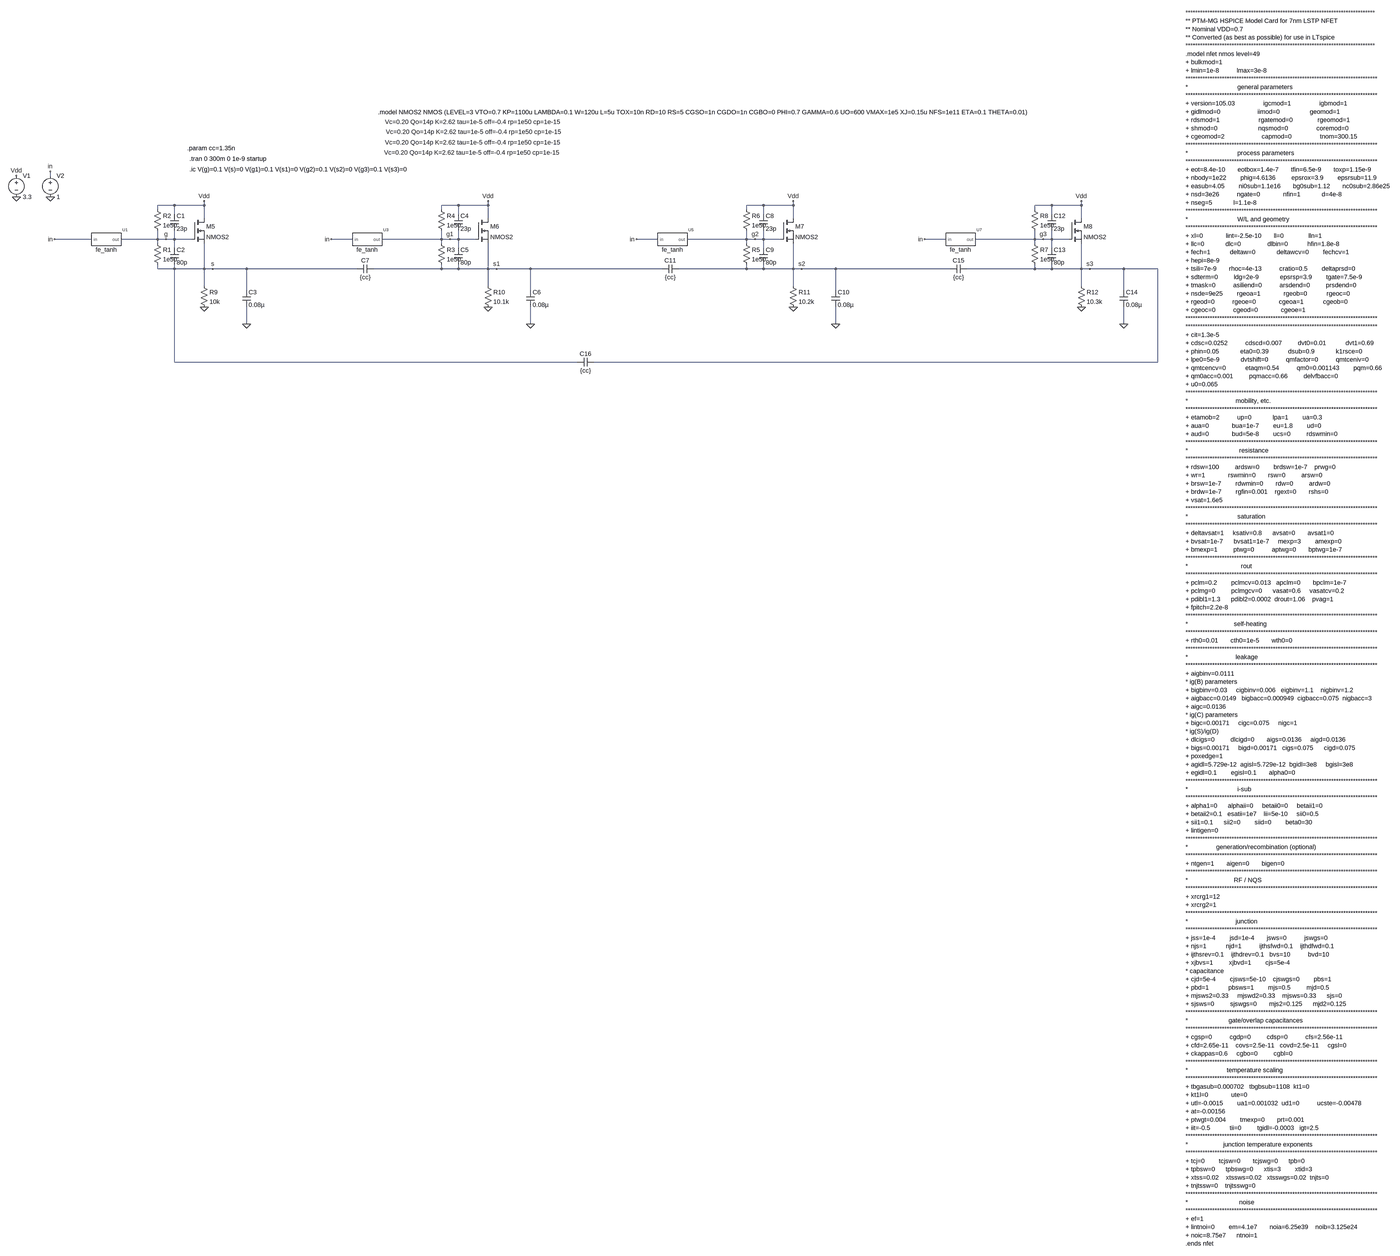
[diagram p0: schematic Oscilador_coupled_transistors.asc, whole sheet]
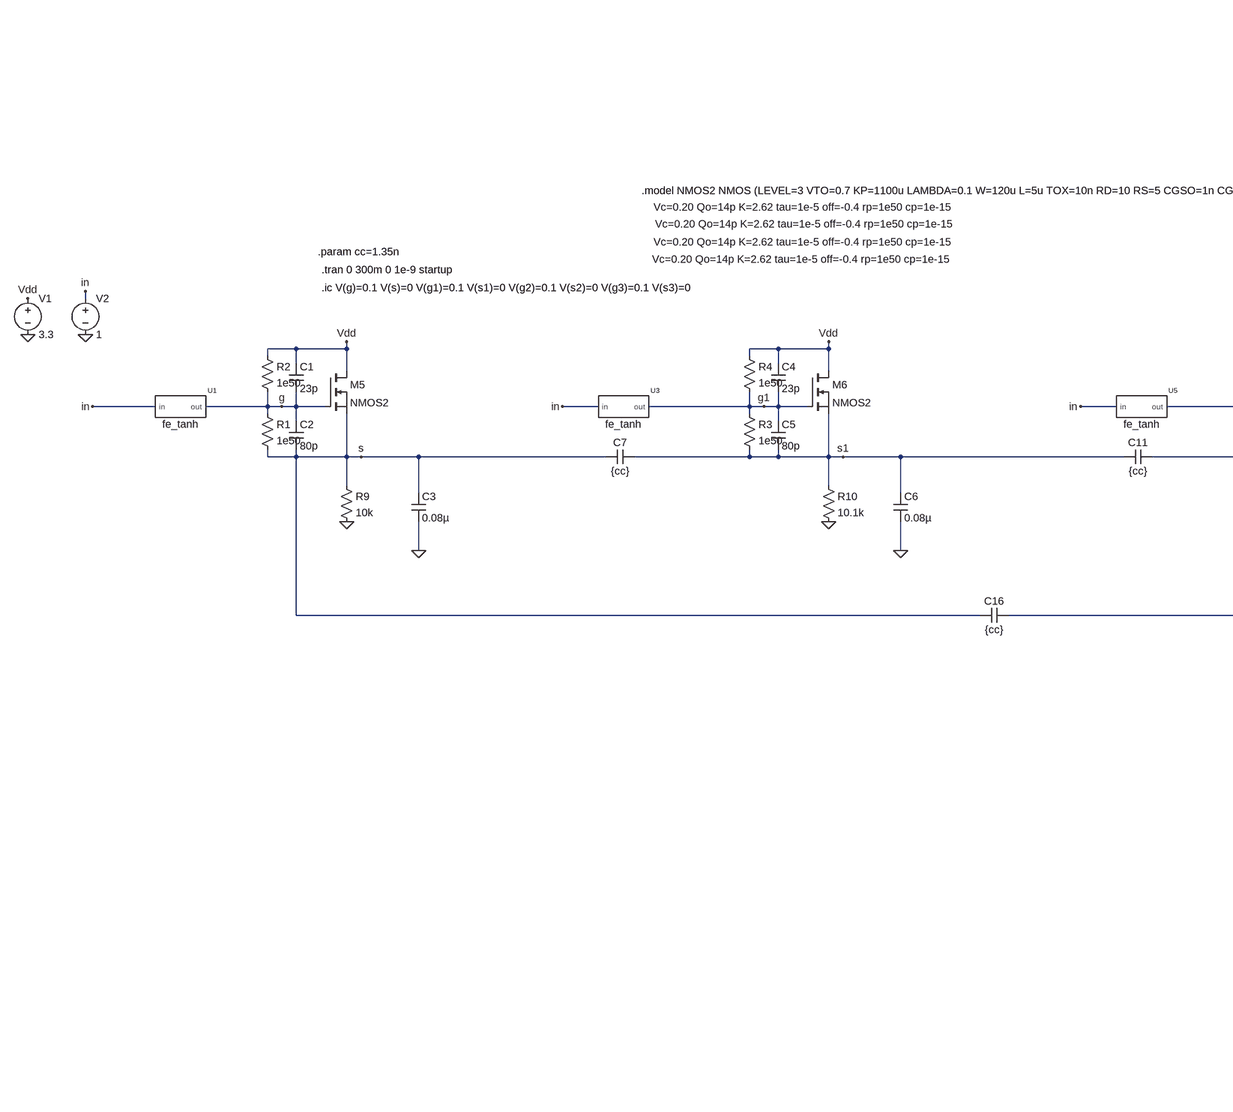
[diagram p1: schematic Oscilador_coupled_transistors.asc, part, row 1 of 2, column 1 of 2]
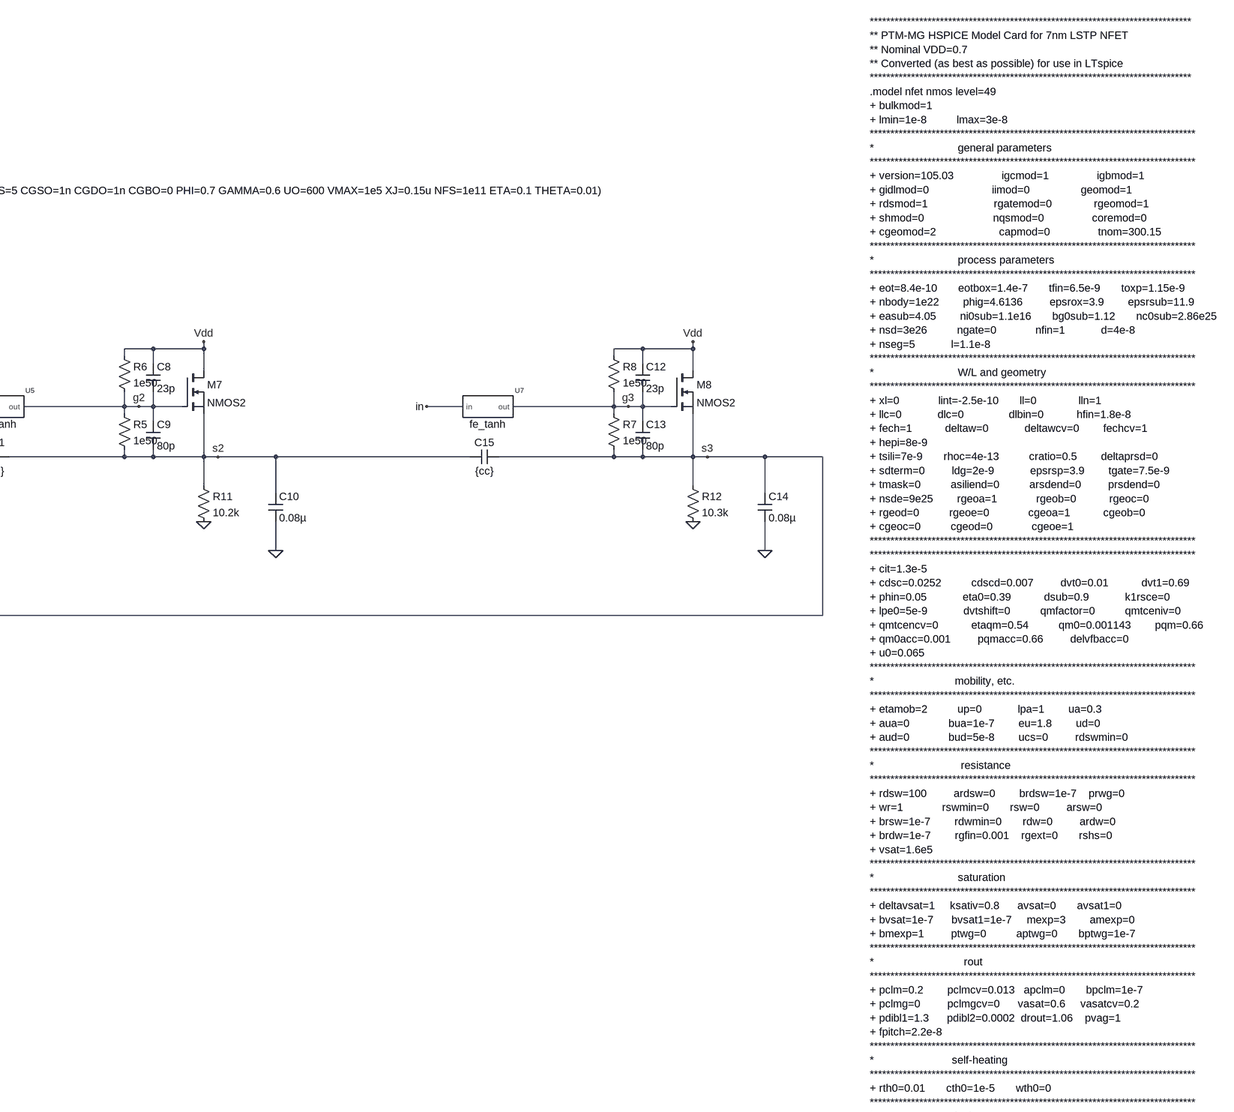
[diagram p2: schematic Oscilador_coupled_transistors.asc, part, row 1 of 2, column 2 of 2]
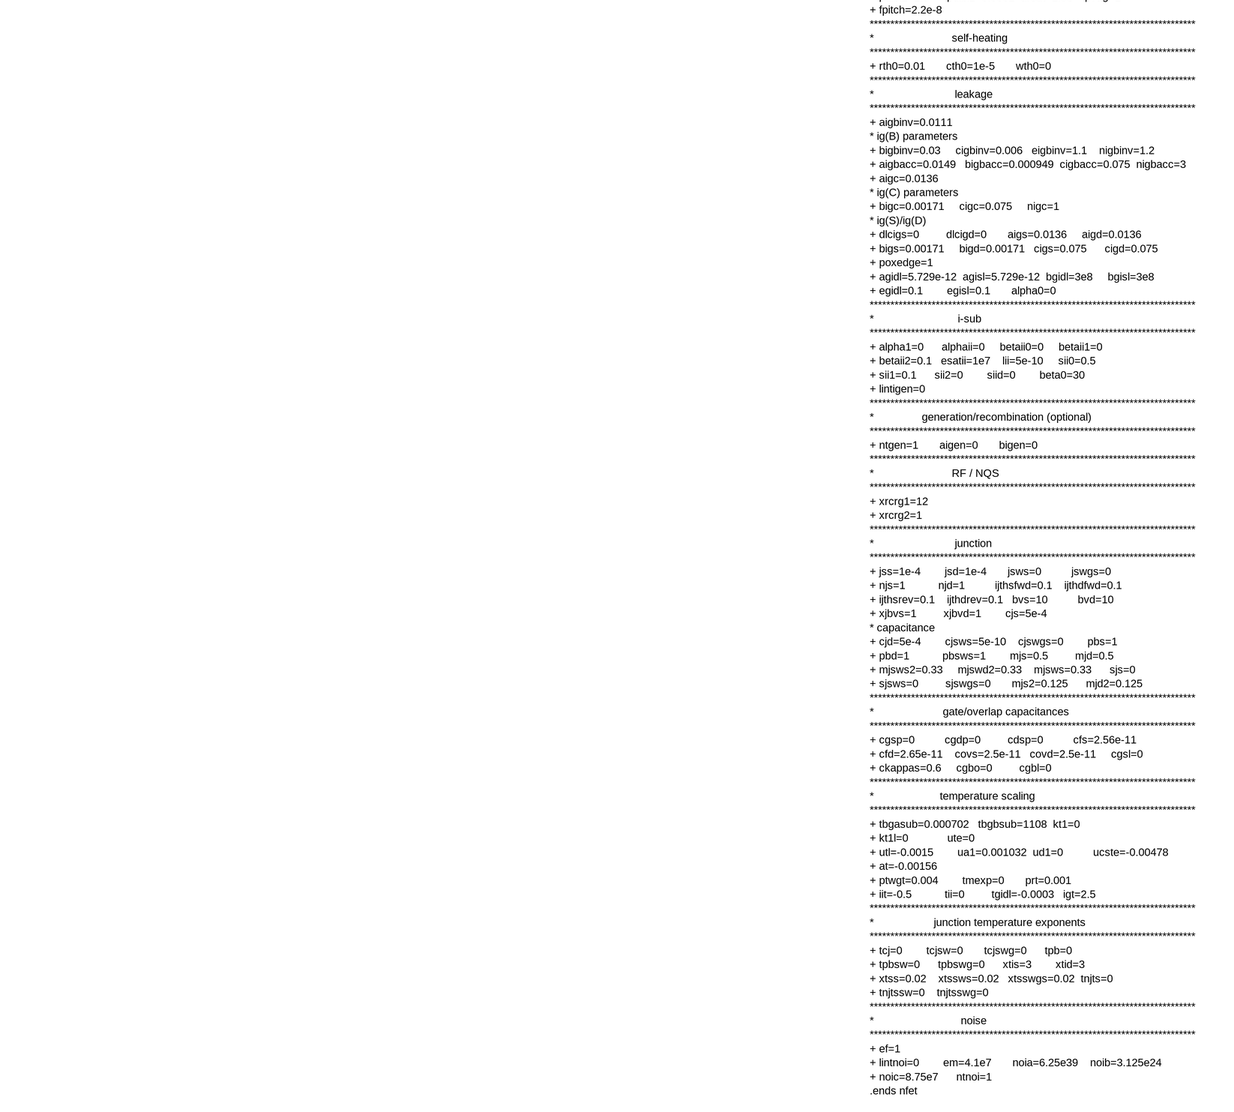
[diagram p3: schematic Oscilador_coupled_transistors.asc, part, row 2 of 2, column 2 of 2]
Oscilador_coupled_transistors.asc, the LTspice schematic file:
Version 4
SHEET 1 6256 3524
WIRE -128 -48 -128 -64
WIRE 576 64 512 64
WIRE 688 64 688 48
WIRE 688 64 576 64
WIRE 1648 64 1584 64
WIRE 1760 64 1760 48
WIRE 1760 64 1648 64
WIRE 2800 64 2736 64
WIRE 2912 64 2912 48
WIRE 2912 64 2800 64
WIRE 3888 64 3824 64
WIRE 4000 64 4000 48
WIRE 4000 64 3888 64
WIRE 512 80 512 64
WIRE 1584 80 1584 64
WIRE 2736 80 2736 64
WIRE 3824 80 3824 64
WIRE 576 96 576 64
WIRE 1648 96 1648 64
WIRE 2800 96 2800 64
WIRE 3888 96 3888 64
WIRE 688 112 688 64
WIRE 1760 112 1760 64
WIRE 2912 112 2912 64
WIRE 4000 112 4000 64
WIRE 176 192 -112 192
WIRE 512 192 512 160
WIRE 512 192 288 192
WIRE 544 192 512 192
WIRE 576 192 576 160
WIRE 576 192 544 192
WIRE 640 192 576 192
WIRE 1248 192 1168 192
WIRE 1584 192 1584 160
WIRE 1584 192 1360 192
WIRE 1616 192 1584 192
WIRE 1648 192 1648 160
WIRE 1648 192 1616 192
WIRE 1712 192 1648 192
WIRE 2400 192 2320 192
WIRE 2736 192 2736 160
WIRE 2736 192 2512 192
WIRE 2768 192 2736 192
WIRE 2800 192 2800 160
WIRE 2800 192 2768 192
WIRE 2864 192 2800 192
WIRE 3488 192 3408 192
WIRE 3824 192 3824 160
WIRE 3824 192 3600 192
WIRE 3856 192 3824 192
WIRE 3888 192 3888 160
WIRE 3888 192 3856 192
WIRE 3952 192 3888 192
WIRE 512 208 512 192
WIRE 1584 208 1584 192
WIRE 2736 208 2736 192
WIRE 3824 208 3824 192
WIRE 576 224 576 192
WIRE 1648 224 1648 192
WIRE 2800 224 2800 192
WIRE 3888 224 3888 192
WIRE 512 304 512 288
WIRE 576 304 576 288
WIRE 576 304 512 304
WIRE 688 304 688 208
WIRE 688 304 576 304
WIRE 720 304 688 304
WIRE 848 304 720 304
WIRE 1264 304 848 304
WIRE 1584 304 1584 288
WIRE 1584 304 1328 304
WIRE 1648 304 1648 288
WIRE 1648 304 1584 304
WIRE 1760 304 1760 208
WIRE 1760 304 1648 304
WIRE 1792 304 1760 304
WIRE 1920 304 1792 304
WIRE 2416 304 1920 304
WIRE 2736 304 2736 288
WIRE 2736 304 2480 304
WIRE 2800 304 2800 288
WIRE 2800 304 2736 304
WIRE 2912 304 2912 208
WIRE 2912 304 2800 304
WIRE 2944 304 2912 304
WIRE 3072 304 2944 304
WIRE 3504 304 3072 304
WIRE 3824 304 3824 288
WIRE 3824 304 3568 304
WIRE 3888 304 3888 288
WIRE 3888 304 3824 304
WIRE 4000 304 4000 208
WIRE 4000 304 3888 304
WIRE 4032 304 4000 304
WIRE 4160 304 4032 304
WIRE 4288 304 4160 304
WIRE 688 368 688 304
WIRE 1760 368 1760 304
WIRE 2912 368 2912 304
WIRE 4000 368 4000 304
WIRE 848 384 848 304
WIRE 1920 384 1920 304
WIRE 3072 384 3072 304
WIRE 4160 384 4160 304
WIRE 848 512 848 448
WIRE 1920 512 1920 448
WIRE 3072 512 3072 448
WIRE 4160 512 4160 448
WIRE 576 656 576 304
WIRE 2096 656 576 656
WIRE 4288 656 4288 304
WIRE 4288 656 2160 656
FLAG -256 32 0
FLAG -256 -48 Vdd
FLAG 688 48 Vdd
FLAG 848 512 0
FLAG -128 32 0
FLAG -112 192 in
FLAG -128 -64 in
FLAG 544 192 g
FLAG 720 304 s
FLAG 1760 48 Vdd
FLAG 1920 512 0
FLAG 1168 192 in
FLAG 1616 192 g1
FLAG 1792 304 s1
FLAG 2912 48 Vdd
FLAG 3072 512 0
FLAG 2320 192 in
FLAG 2768 192 g2
FLAG 2944 304 s2
FLAG 4000 48 Vdd
FLAG 4160 512 0
FLAG 3408 192 in
FLAG 3856 192 g3
FLAG 4032 304 s3
FLAG 4000 448 0
FLAG 2912 448 0
FLAG 1760 448 0
FLAG 688 448 0
SYMBOL voltage -256 -64 R0
WINDOW 123 0 0 Left 0
WINDOW 39 0 0 Left 0
SYMATTR InstName V1
SYMATTR Value 3.3
SYMBOL cap 560 96 R0
SYMATTR InstName C1
SYMATTR Value 23p
SYMBOL cap 560 224 R0
SYMATTR InstName C2
SYMATTR Value 80p
SYMBOL res 496 192 R0
SYMATTR InstName R1
SYMATTR Value 1e50
SYMBOL res 496 64 R0
SYMATTR InstName R2
SYMATTR Value 1e50
SYMBOL cap 832 384 R0
SYMATTR InstName C3
SYMATTR Value 0.08µ
SYMBOL voltage -128 -64 R0
WINDOW 123 0 0 Left 0
WINDOW 39 0 0 Left 0
SYMATTR InstName V2
SYMATTR Value 1
SYMBOL fe_tanh 224 192 R0
WINDOW 39 1480 -459 Top 2
SYMATTR SpiceLine Vc=0.20 Qo=14p K=2.62 tau=1e-5 off=-0.4 rp=1e50 cp=1e-15
SYMATTR InstName U1
SYMBOL cap 1632 96 R0
SYMATTR InstName C4
SYMATTR Value 23p
SYMBOL cap 1632 224 R0
SYMATTR InstName C5
SYMATTR Value 80p
SYMBOL res 1568 192 R0
SYMATTR InstName R3
SYMATTR Value 1e50
SYMBOL res 1568 64 R0
SYMATTR InstName R4
SYMATTR Value 1e50
SYMBOL cap 1904 384 R0
SYMATTR InstName C6
SYMATTR Value 0.08µ
SYMBOL fe_tanh 1296 192 R0
WINDOW 39 411 -421 Top 2
SYMATTR SpiceLine Vc=0.20 Qo=14p K=2.62 tau=1e-5 off=-0.4 rp=1e50 cp=1e-15
SYMATTR InstName U3
SYMBOL cap 1328 288 R90
WINDOW 0 0 32 VBottom 2
WINDOW 3 32 32 VTop 2
SYMATTR InstName C7
SYMATTR Value {cc}
SYMBOL cap 2784 96 R0
SYMATTR InstName C8
SYMATTR Value 23p
SYMBOL cap 2784 224 R0
SYMATTR InstName C9
SYMATTR Value 80p
SYMBOL res 2720 192 R0
SYMATTR InstName R5
SYMATTR Value 1e50
SYMBOL res 2720 64 R0
SYMATTR InstName R6
SYMATTR Value 1e50
SYMBOL cap 3056 384 R0
SYMATTR InstName C10
SYMATTR Value 0.08µ
SYMBOL fe_tanh 2448 192 R0
WINDOW 39 -744 -381 Top 2
SYMATTR SpiceLine Vc=0.20 Qo=14p K=2.62 tau=1e-5 off=-0.4 rp=1e50 cp=1e-15
SYMATTR InstName U5
SYMBOL cap 2480 288 R90
WINDOW 0 0 32 VBottom 2
WINDOW 3 32 32 VTop 2
SYMATTR InstName C11
SYMATTR Value {cc}
SYMBOL cap 3872 96 R0
SYMATTR InstName C12
SYMATTR Value 23p
SYMBOL cap 3872 224 R0
SYMATTR InstName C13
SYMATTR Value 80p
SYMBOL res 3808 192 R0
SYMATTR InstName R7
SYMATTR Value 1e50
SYMBOL res 3808 64 R0
SYMATTR InstName R8
SYMATTR Value 1e50
SYMBOL cap 4144 384 R0
SYMATTR InstName C14
SYMATTR Value 0.08µ
SYMBOL fe_tanh 3536 192 R0
WINDOW 39 -1836 -343 Top 2
SYMATTR SpiceLine Vc=0.20 Qo=14p K=2.62 tau=1e-5 off=-0.4 rp=1e50 cp=1e-15
SYMATTR InstName U7
SYMBOL cap 3568 288 R90
WINDOW 0 0 32 VBottom 2
WINDOW 3 32 32 VTop 2
SYMATTR InstName C15
SYMATTR Value {cc}
SYMBOL cap 2160 640 R90
WINDOW 0 0 32 VBottom 2
WINDOW 3 32 32 VTop 2
SYMATTR InstName C16
SYMATTR Value {cc}
SYMBOL nmos 640 112 R0
SYMATTR InstName M5
SYMATTR Value NMOS2
SYMBOL nmos 1712 112 R0
SYMATTR InstName M6
SYMATTR Value NMOS2
SYMBOL nmos 2864 112 R0
SYMATTR InstName M7
SYMATTR Value NMOS2
SYMBOL nmos 3952 112 R0
SYMATTR InstName M8
SYMATTR Value NMOS2
SYMBOL res 672 352 R0
SYMATTR InstName R9
SYMATTR Value 10k
SYMBOL res 1744 352 R0
SYMATTR InstName R10
SYMATTR Value 10.1k
SYMBOL res 2896 352 R0
SYMATTR InstName R11
SYMATTR Value 10.2k
SYMBOL res 3984 352 R0
SYMATTR InstName R12
SYMATTR Value 10.3k
TEXT 632 -72 Left 2 !.ic V(g)=0.1 V(s)=0 V(g1)=0.1 V(s1)=0 V(g2)=0.1 V(s2)=0 V(g3)=0.1 V(s3)=0
TEXT 632 -112 Left 2 !.tran 0 300m 0 1e-9 startup
TEXT 624 -152 Left 2 !.param cc=1.35n
TEXT 1344 -288 Left 2 !.model NMOS2 NMOS (LEVEL=3 VTO=0.7 KP=1100u LAMBDA=0.1 W=120u L=5u TOX=10n RD=10 RS=5 CGSO=1n CGDO=1n CGBO=0 PHI=0.7 GAMMA=0.6 UO=600 VMAX=1e5 XJ=0.15u NFS=1e11 ETA=0.1 THETA=0.01)
TEXT 4920 -664 Left 2 !******************************************************************************\n** PTM-MG HSPICE Model Card for 7nm LSTP NFET \n** Nominal VDD=0.7\n** Converted (as best as possible) for use in LTspice\n******************************************************************************\n.model nfet nmos level=49\n+ bulkmod=1\n+ lmin=1e-8          lmax=3e-8\n*******************************************************************************\n*                            general parameters\n*******************************************************************************\n+ version=105.03                igcmod=1                igbmod=1\n+ gidlmod=0                     iimod=0                 geomod=1\n+ rdsmod=1                      rgatemod=0              rgeomod=1\n+ shmod=0                       nqsmod=0                coremod=0\n+ cgeomod=2                     capmod=0                tnom=300.15\n*******************************************************************************\n*                            process parameters\n*******************************************************************************\n+ eot=8.4e-10       eotbox=1.4e-7       tfin=6.5e-9       toxp=1.15e-9\n+ nbody=1e22        phig=4.6136         epsrox=3.9        epsrsub=11.9\n+ easub=4.05        ni0sub=1.1e16       bg0sub=1.12       nc0sub=2.86e25\n+ nsd=3e26          ngate=0             nfin=1            d=4e-8\n+ nseg=5            l=1.1e-8\n*******************************************************************************\n*                            W/L and geometry\n*******************************************************************************\n+ xl=0             lint=-2.5e-10       ll=0              lln=1\n+ llc=0            dlc=0               dlbin=0           hfin=1.8e-8\n+ fech=1           deltaw=0            deltawcv=0        fechcv=1\n+ hepi=8e-9\n+ tsili=7e-9       rhoc=4e-13          cratio=0.5        deltaprsd=0\n+ sdterm=0         ldg=2e-9            epsrsp=3.9        tgate=7.5e-9\n+ tmask=0          asiliend=0          arsdend=0         prsdend=0\n+ nsde=9e25        rgeoa=1             rgeob=0           rgeoc=0\n+ rgeod=0          rgeoe=0             cgeoa=1           cgeob=0\n+ cgeoc=0          cgeod=0             cgeoe=1\n*******************************************************************************\n*******************************************************************************\n+ cit=1.3e-5\n+ cdsc=0.0252          cdscd=0.007         dvt0=0.01           dvt1=0.69\n+ phin=0.05            eta0=0.39           dsub=0.9            k1rsce=0\n+ lpe0=5e-9            dvtshift=0          qmfactor=0          qmtceniv=0\n+ qmtcencv=0           etaqm=0.54          qm0=0.001143        pqm=0.66\n+ qm0acc=0.001         pqmacc=0.66         delvfbacc=0\n+ u0=0.065\n*******************************************************************************\n*                           mobility, etc.\n*******************************************************************************\n+ etamob=2          up=0            lpa=1        ua=0.3\n+ aua=0             bua=1e-7        eu=1.8        ud=0\n+ aud=0             bud=5e-8        ucs=0         rdswmin=0\n*******************************************************************************\n*                             resistance\n*******************************************************************************\n+ rdsw=100         ardsw=0        brdsw=1e-7    prwg=0\n+ wr=1             rswmin=0       rsw=0         arsw=0\n+ brsw=1e-7        rdwmin=0       rdw=0         ardw=0\n+ brdw=1e-7        rgfin=0.001    rgext=0       rshs=0\n+ vsat=1.6e5\n*******************************************************************************\n*                            saturation\n*******************************************************************************\n+ deltavsat=1     ksativ=0.8      avsat=0       avsat1=0\n+ bvsat=1e-7      bvsat1=1e-7     mexp=3        amexp=0\n+ bmexp=1         ptwg=0          aptwg=0       bptwg=1e-7\n*******************************************************************************\n*                              rout\n*******************************************************************************\n+ pclm=0.2        pclmcv=0.013   apclm=0       bpclm=1e-7\n+ pclmg=0         pclmgcv=0      vasat=0.6     vasatcv=0.2\n+ pdibl1=1.3      pdibl2=0.0002  drout=1.06    pvag=1\n+ fpitch=2.2e-8\n*******************************************************************************\n*                          self-heating\n*******************************************************************************\n+ rth0=0.01       cth0=1e-5       wth0=0\n*******************************************************************************\n*                           leakage\n*******************************************************************************\n+ aigbinv=0.0111\n* ig(B) parameters\n+ bigbinv=0.03     cigbinv=0.006   eigbinv=1.1    nigbinv=1.2\n+ aigbacc=0.0149   bigbacc=0.000949  cigbacc=0.075  nigbacc=3\n+ aigc=0.0136\n* ig(C) parameters\n+ bigc=0.00171     cigc=0.075     nigc=1\n* ig(S)/ig(D)\n+ dlcigs=0         dlcigd=0       aigs=0.0136     aigd=0.0136\n+ bigs=0.00171     bigd=0.00171   cigs=0.075      cigd=0.075\n+ poxedge=1\n+ agidl=5.729e-12  agisl=5.729e-12  bgidl=3e8     bgisl=3e8\n+ egidl=0.1        egisl=0.1       alpha0=0\n*******************************************************************************\n*                            i-sub\n*******************************************************************************\n+ alpha1=0      alphaii=0     betaii0=0     betaii1=0\n+ betaii2=0.1   esatii=1e7    lii=5e-10     sii0=0.5\n+ sii1=0.1      sii2=0        siid=0        beta0=30\n+ lintigen=0\n*******************************************************************************\n*                generation/recombination (optional)\n*******************************************************************************\n+ ntgen=1       aigen=0       bigen=0\n*******************************************************************************\n*                          RF / NQS\n*******************************************************************************\n+ xrcrg1=12\n+ xrcrg2=1\n*******************************************************************************\n*                           junction\n*******************************************************************************\n+ jss=1e-4        jsd=1e-4       jsws=0          jswgs=0\n+ njs=1           njd=1          ijthsfwd=0.1    ijthdfwd=0.1\n+ ijthsrev=0.1    ijthdrev=0.1   bvs=10          bvd=10\n+ xjbvs=1         xjbvd=1        cjs=5e-4\n* capacitance\n+ cjd=5e-4        cjsws=5e-10    cjswgs=0        pbs=1\n+ pbd=1           pbsws=1        mjs=0.5         mjd=0.5\n+ mjsws2=0.33     mjswd2=0.33    mjsws=0.33      sjs=0\n+ sjsws=0         sjswgs=0       mjs2=0.125      mjd2=0.125\n*******************************************************************************\n*                       gate/overlap capacitances\n*******************************************************************************\n+ cgsp=0          cgdp=0         cdsp=0          cfs=2.56e-11\n+ cfd=2.65e-11    covs=2.5e-11   covd=2.5e-11     cgsl=0\n+ ckappas=0.6     cgbo=0         cgbl=0\n*******************************************************************************\n*                      temperature scaling\n*******************************************************************************\n+ tbgasub=0.000702   tbgbsub=1108  kt1=0\n+ kt1l=0             ute=0\n+ utl=-0.0015        ua1=0.001032  ud1=0          ucste=-0.00478\n+ at=-0.00156\n+ ptwgt=0.004        tmexp=0       prt=0.001\n+ iit=-0.5           tii=0         tgidl=-0.0003   igt=2.5\n*******************************************************************************\n*                    junction temperature exponents\n*******************************************************************************\n+ tcj=0        tcjsw=0       tcjswg=0      tpb=0\n+ tpbsw=0      tpbswg=0      xtis=3        xtid=3\n+ xtss=0.02    xtssws=0.02   xtsswgs=0.02  tnjts=0\n+ tnjtssw=0    tnjtsswg=0\n*******************************************************************************\n*                             noise\n*******************************************************************************\n+ ef=1\n+ lintnoi=0        em=4.1e7       noia=6.25e39    noib=3.125e24\n+ noic=8.75e7      ntnoi=1\n.ends nfet

The netlist it stands for:
* Oscilador_coupled_transistors.asc
V1 Vdd 0 3.3
C1 Vdd g 23p
C2 g s 80p
R1 g s 1e50
R2 Vdd g 1e50
C3 s 0 0.08µ
V2 in 0 1
XU1 in g fe_tanh Vc=0.20 Qo=14p K=2.62 tau=1e-5 off=-0.4 rp=1e50 cp=1e-15  ; pins in out
C4 Vdd g1 23p
C5 g1 s1 80p
R3 g1 s1 1e50
R4 Vdd g1 1e50
C6 s1 0 0.08µ
XU3 in g1 fe_tanh Vc=0.20 Qo=14p K=2.62 tau=1e-5 off=-0.4 rp=1e50 cp=1e-15  ; pins in out
C7 s1 s {cc}
C8 Vdd g2 23p
C9 g2 s2 80p
R5 g2 s2 1e50
R6 Vdd g2 1e50
C10 s2 0 0.08µ
XU5 in g2 fe_tanh Vc=0.20 Qo=14p K=2.62 tau=1e-5 off=-0.4 rp=1e50 cp=1e-15  ; pins in out
C11 s2 s1 {cc}
C12 Vdd g3 23p
C13 g3 s3 80p
R7 g3 s3 1e50
R8 Vdd g3 1e50
C14 s3 0 0.08µ
XU7 in g3 fe_tanh Vc=0.20 Qo=14p K=2.62 tau=1e-5 off=-0.4 rp=1e50 cp=1e-15  ; pins in out
C15 s3 s2 {cc}
C16 s3 s {cc}
M5 Vdd g s s NMOS2
M6 Vdd g1 s1 s1 NMOS2
M7 Vdd g2 s2 s2 NMOS2
M8 Vdd g3 s3 s3 NMOS2
R9 s 0 10k
R10 s1 0 10.1k
R11 s2 0 10.2k
R12 s3 0 10.3k
.model NMOS NMOS
.model PMOS PMOS
.lib standard.mos
.ic V(g)=0.1 V(s)=0 V(g1)=0.1 V(s1)=0 V(g2)=0.1 V(s2)=0 V(g3)=0.1 V(s3)=0
.tran 0 300m 0 1e-9 startup
.param cc=1.35n
.model NMOS2 NMOS (LEVEL=3 VTO=0.7 KP=1100u LAMBDA=0.1 W=120u L=5u TOX=10n RD=10 RS=5 CGSO=1n CGDO=1n CGBO=0 PHI=0.7 GAMMA=0.6 UO=600 VMAX=1e5 XJ=0.15u NFS=1e11 ETA=0.1 THETA=0.01)
******************************************************************************
** PTM-MG HSPICE Model Card for 7nm LSTP NFET
** Nominal VDD=0.7
** Converted (as best as possible) for use in LTspice
******************************************************************************
.model nfet nmos level=49
+ bulkmod=1
+ lmin=1e-8          lmax=3e-8
*******************************************************************************
*                            general parameters
*******************************************************************************
+ version=105.03                igcmod=1                igbmod=1
+ gidlmod=0                     iimod=0                 geomod=1
+ rdsmod=1                      rgatemod=0              rgeomod=1
+ shmod=0                       nqsmod=0                coremod=0
+ cgeomod=2                     capmod=0                tnom=300.15
*******************************************************************************
*                            process parameters
*******************************************************************************
+ eot=8.4e-10       eotbox=1.4e-7       tfin=6.5e-9       toxp=1.15e-9
+ nbody=1e22        phig=4.6136         epsrox=3.9        epsrsub=11.9
+ easub=4.05        ni0sub=1.1e16       bg0sub=1.12       nc0sub=2.86e25
+ nsd=3e26          ngate=0             nfin=1            d=4e-8
+ nseg=5            l=1.1e-8
*******************************************************************************
*                            W/L and geometry
*******************************************************************************
+ xl=0             lint=-2.5e-10       ll=0              lln=1
+ llc=0            dlc=0               dlbin=0           hfin=1.8e-8
+ fech=1           deltaw=0            deltawcv=0        fechcv=1
+ hepi=8e-9
+ tsili=7e-9       rhoc=4e-13          cratio=0.5        deltaprsd=0
+ sdterm=0         ldg=2e-9            epsrsp=3.9        tgate=7.5e-9
+ tmask=0          asiliend=0          arsdend=0         prsdend=0
+ nsde=9e25        rgeoa=1             rgeob=0           rgeoc=0
+ rgeod=0          rgeoe=0             cgeoa=1           cgeob=0
+ cgeoc=0          cgeod=0             cgeoe=1
*******************************************************************************
*******************************************************************************
+ cit=1.3e-5
+ cdsc=0.0252          cdscd=0.007         dvt0=0.01           dvt1=0.69
+ phin=0.05            eta0=0.39           dsub=0.9            k1rsce=0
+ lpe0=5e-9            dvtshift=0          qmfactor=0          qmtceniv=0
+ qmtcencv=0           etaqm=0.54          qm0=0.001143        pqm=0.66
+ qm0acc=0.001         pqmacc=0.66         delvfbacc=0
+ u0=0.065
*******************************************************************************
*                           mobility, etc.
*******************************************************************************
+ etamob=2          up=0            lpa=1        ua=0.3
+ aua=0             bua=1e-7        eu=1.8        ud=0
+ aud=0             bud=5e-8        ucs=0         rdswmin=0
*******************************************************************************
*                             resistance
*******************************************************************************
+ rdsw=100         ardsw=0        brdsw=1e-7    prwg=0
+ wr=1             rswmin=0       rsw=0         arsw=0
+ brsw=1e-7        rdwmin=0       rdw=0         ardw=0
+ brdw=1e-7        rgfin=0.001    rgext=0       rshs=0
+ vsat=1.6e5
*******************************************************************************
*                            saturation
*******************************************************************************
+ deltavsat=1     ksativ=0.8      avsat=0       avsat1=0
+ bvsat=1e-7      bvsat1=1e-7     mexp=3        amexp=0
+ bmexp=1         ptwg=0          aptwg=0       bptwg=1e-7
*******************************************************************************
*                              rout
*******************************************************************************
+ pclm=0.2        pclmcv=0.013   apclm=0       bpclm=1e-7
+ pclmg=0         pclmgcv=0      vasat=0.6     vasatcv=0.2
+ pdibl1=1.3      pdibl2=0.0002  drout=1.06    pvag=1
+ fpitch=2.2e-8
*******************************************************************************
*                          self-heating
*******************************************************************************
+ rth0=0.01       cth0=1e-5       wth0=0
*******************************************************************************
*                           leakage
*******************************************************************************
+ aigbinv=0.0111
* ig(B) parameters
+ bigbinv=0.03     cigbinv=0.006   eigbinv=1.1    nigbinv=1.2
+ aigbacc=0.0149   bigbacc=0.000949  cigbacc=0.075  nigbacc=3
+ aigc=0.0136
* ig(C) parameters
+ bigc=0.00171     cigc=0.075     nigc=1
* ig(S)/ig(D)
+ dlcigs=0         dlcigd=0       aigs=0.0136     aigd=0.0136
+ bigs=0.00171     bigd=0.00171   cigs=0.075      cigd=0.075
+ poxedge=1
+ agidl=5.729e-12  agisl=5.729e-12  bgidl=3e8     bgisl=3e8
+ egidl=0.1        egisl=0.1       alpha0=0
*******************************************************************************
*                            i-sub
*******************************************************************************
+ alpha1=0      alphaii=0     betaii0=0     betaii1=0
+ betaii2=0.1   esatii=1e7    lii=5e-10     sii0=0.5
+ sii1=0.1      sii2=0        siid=0        beta0=30
+ lintigen=0
*******************************************************************************
*                generation/recombination (optional)
*******************************************************************************
+ ntgen=1       aigen=0       bigen=0
*******************************************************************************
*                          RF / NQS
*******************************************************************************
+ xrcrg1=12
+ xrcrg2=1
*******************************************************************************
*                           junction
*******************************************************************************
+ jss=1e-4        jsd=1e-4       jsws=0          jswgs=0
+ njs=1           njd=1          ijthsfwd=0.1    ijthdfwd=0.1
+ ijthsrev=0.1    ijthdrev=0.1   bvs=10          bvd=10
+ xjbvs=1         xjbvd=1        cjs=5e-4
* capacitance
+ cjd=5e-4        cjsws=5e-10    cjswgs=0        pbs=1
+ pbd=1           pbsws=1        mjs=0.5         mjd=0.5
+ mjsws2=0.33     mjswd2=0.33    mjsws=0.33      sjs=0
+ sjsws=0         sjswgs=0       mjs2=0.125      mjd2=0.125
*******************************************************************************
*                       gate/overlap capacitances
*******************************************************************************
+ cgsp=0          cgdp=0         cdsp=0          cfs=2.56e-11
+ cfd=2.65e-11    covs=2.5e-11   covd=2.5e-11     cgsl=0
+ ckappas=0.6     cgbo=0         cgbl=0
*******************************************************************************
*                      temperature scaling
*******************************************************************************
+ tbgasub=0.000702   tbgbsub=1108  kt1=0
+ kt1l=0             ute=0
+ utl=-0.0015        ua1=0.001032  ud1=0          ucste=-0.00478
+ at=-0.00156
+ ptwgt=0.004        tmexp=0       prt=0.001
+ iit=-0.5           tii=0         tgidl=-0.0003   igt=2.5
*******************************************************************************
*                    junction temperature exponents
*******************************************************************************
+ tcj=0        tcjsw=0       tcjswg=0      tpb=0
+ tpbsw=0      tpbswg=0      xtis=3        xtid=3
+ xtss=0.02    xtssws=0.02   xtsswgs=0.02  tnjts=0
+ tnjtssw=0    tnjtsswg=0
*******************************************************************************
*                             noise
*******************************************************************************
+ ef=1
+ lintnoi=0        em=4.1e7       noia=6.25e39    noib=3.125e24
+ noic=8.75e7      ntnoi=1
.ends nfet
.lib ./fe_tanh_ni.sp
.backanno
.end